# Altium schematic sheet GSM Shutter lock system.SchDoc
size A3; Address1: GSM shutter lock system; SheetNumber: 1; SheetTotal: 1
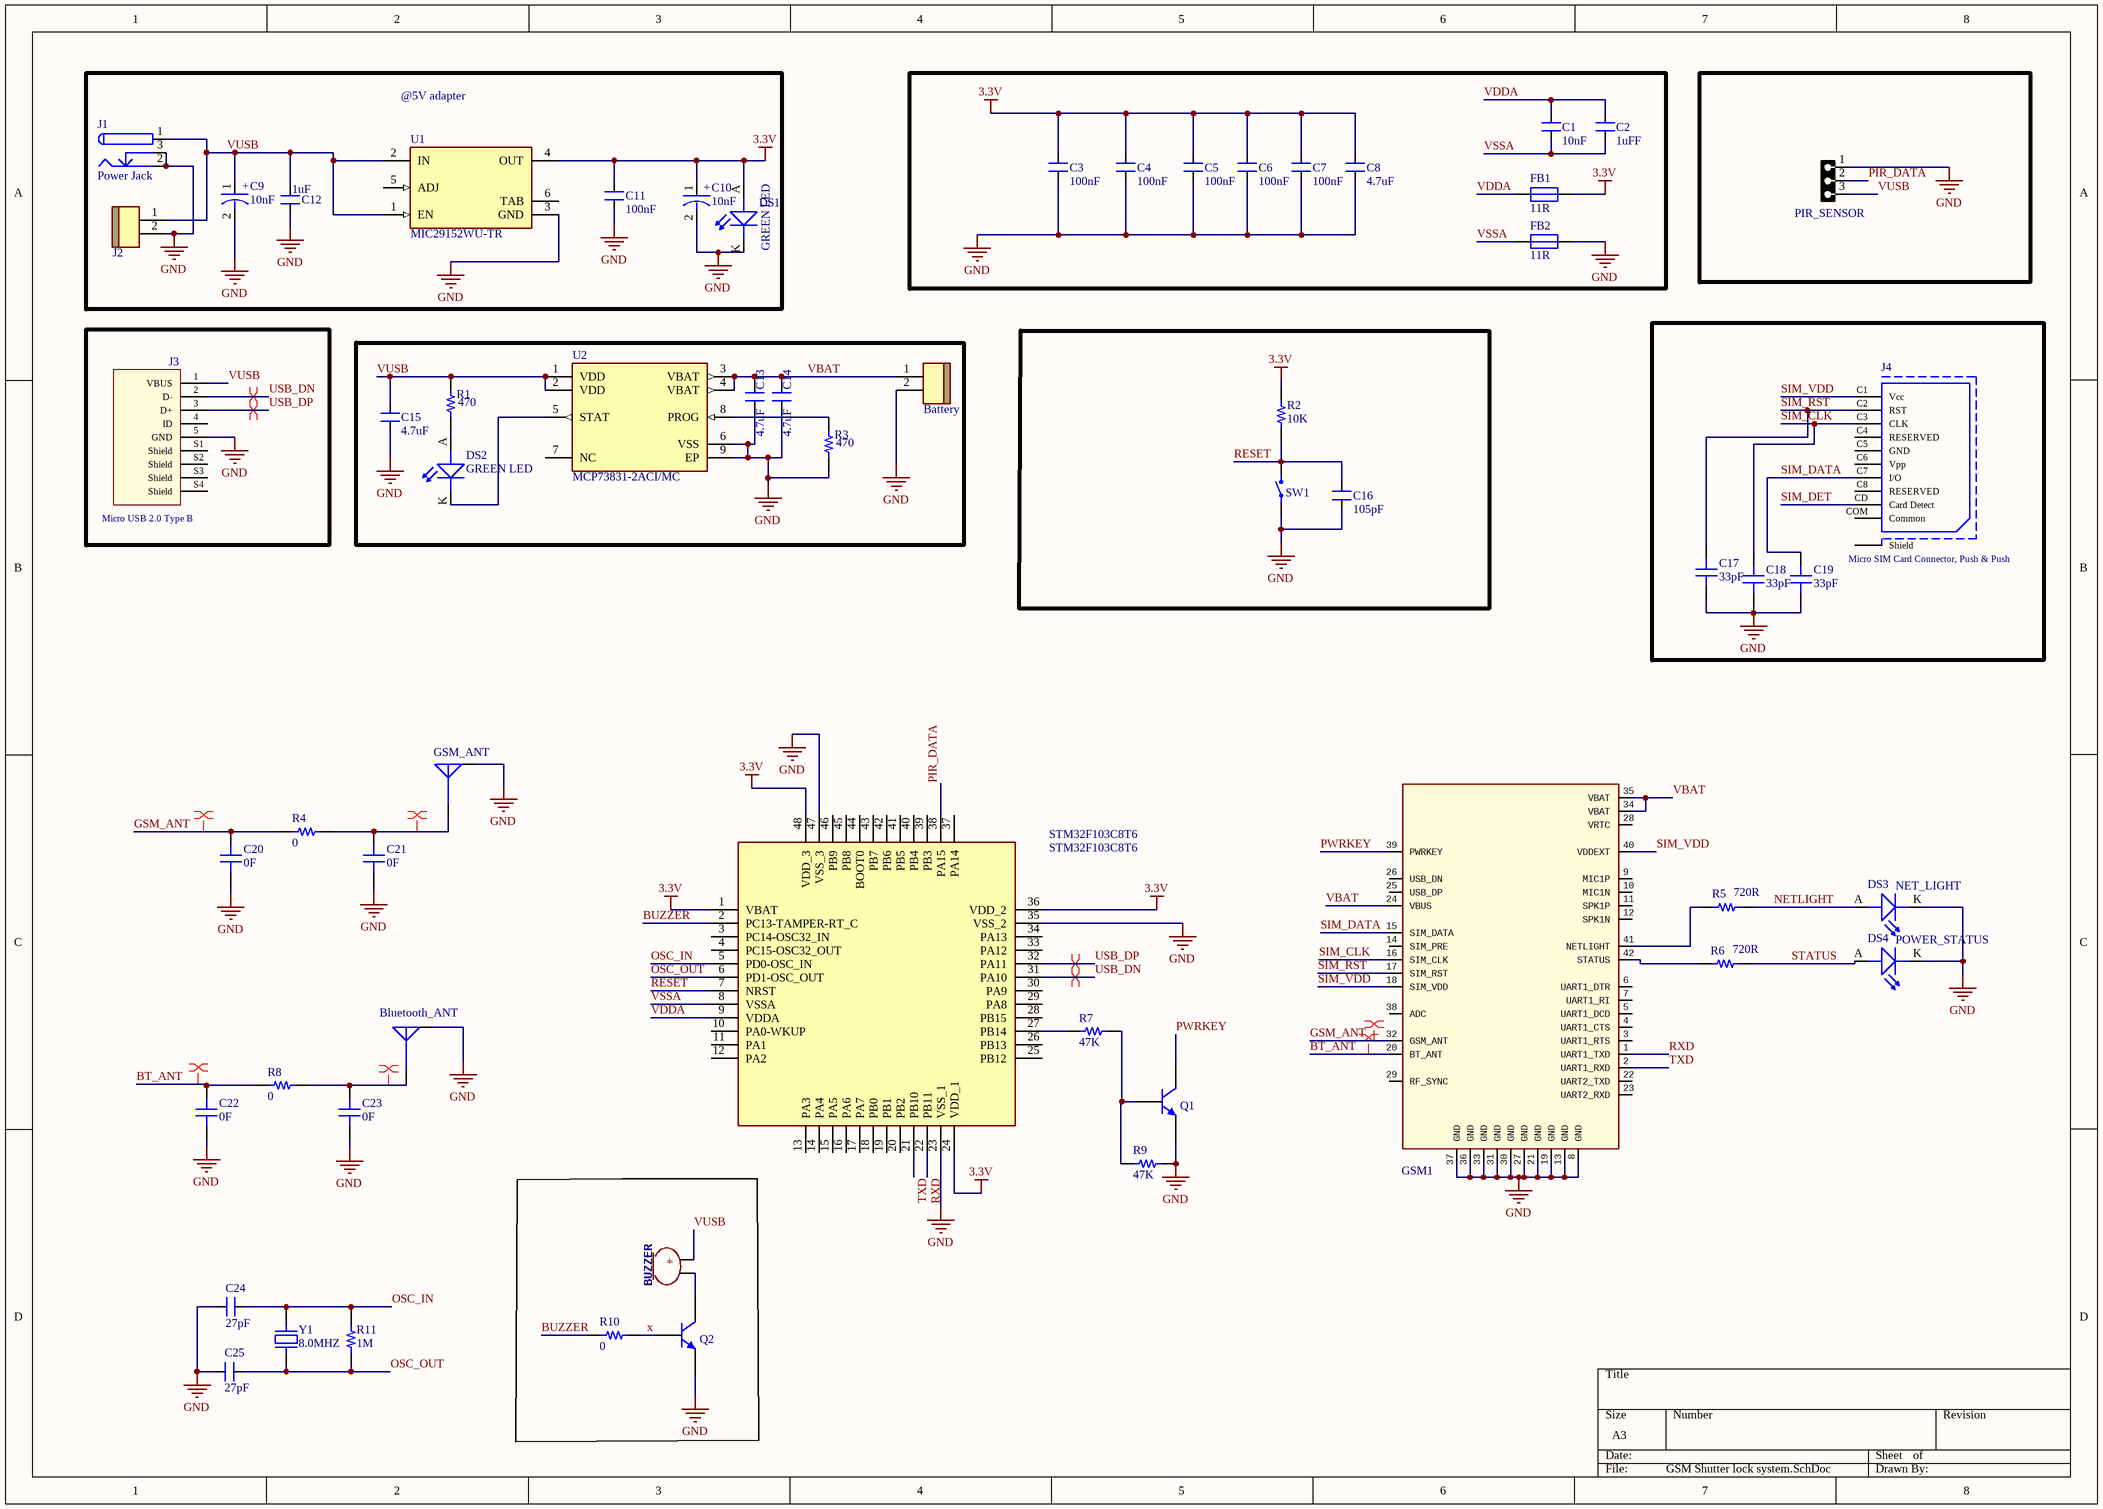
[diagram p0: GSM Shutter lock system.SchDoc]

## Parts
Battery  JST BxB-PH-K 2Pin  [JST B2B-PH-K]  (value not drawn)
Bluetooth_ANT  UFL  [MOLEX SD-734120110]  (value not drawn)
BUZZER  MK  [MIC-9.7MM-TALL]  (value not drawn)
C1  10nF  [CAP_0805]
C2  1uFF  [CAP_0805]
C3  100nF  [CAP_0805]
C4  100nF  [CAP_0805]
C5  100nF  [CAP_0805]
C6  100nF  [CAP_0805]
C7  100nF  [CAP_0805]
C8  4.7uF  [CAP_0805]
C9  10nF  [ACAP_P339_D393_H531_RAD]
C10  10nF  [ACAP_P339_D393_H531_RAD]
C11  100nF  [CAP_0805]
C12  1uF  [CAP_0805]
C13  4.7uF  [CAP_0805]
C14  4.7uF  [CAP_0805]
C15  4.7uF  [CAP_0805]
C16  105pF  [CAP_0805]
C17  33pF  [CAP 0603_1608]
C18  33pF  [CAP 0603_1608]
C19  33pF  [CAP 0603_1608]
C20  0F  [CAP 0402_1005]
C21  0F  [CAP 0402_1005]
C22  0F  [CAP 0402_1005]
C23  0F  [CAP 0402_1005]
C24  27pF  [CAP_0805]
C25  27pF  [CAP_0805]
DS1  GREEN LED  [LED_0805]
DS2  GREEN LED  [LED_0805]
DS3  NET_LIGHT  [LED_0805]
DS4  POWER_STATUS  [LED_0805]
FB1  11R  [IND_0805]
FB2  11R  [IND_0805]
GSM1  SIM800C  [Sim800C]  (value not drawn)
GSM_ANT  UFL  [MOLEX SD-734120110]  (value not drawn)
J1  Power Jack  [DC005]
J2  JST BxB-PH-K 2Pin  [JST B2B-PH-K]  (value not drawn)
J3  Micro USB 2.0 Type B  [629105150521]
J4  Micro SIM Card Connector, Push & Push  [693021010811]
PIR_SENSOR  HDRF3  [HDRLP_F_1X3]  (value not drawn)
Q1  8050  [SOT-23-3 2.9X2.4MM P0.95MM]  (value not drawn)
Q2  8050  [SOT-23-3 2.9X2.4MM P0.95MM]  (value not drawn)
R1  470  [RES 0603_1608]
R2  10K  [RES 0603_1608]
R3  470  [RES 0603_1608]
R4  0  [RES 0402_1005]
R5  720R  [RES 0603_1608]
R6  720R  [RES 0603_1608]
R7  47K  [RES 0603_1608]
R8  0  [RES 0402_1005]
R9  47K  [RES 0603_1608]
R10  0  [RES 0402_1005]
R11  1M  [RES 0603_1608]
STM32F103C8T6  STM32F103C8T6  [LQFP-48_19.6_393_58X11_SMD]
SW1  Tactile 2PIN 6X3.5mm H4.57mm (SMD)  [SWPBS_SPST_6X3X5]  (value not drawn)
U1  MIC29152WU-TR  [FP-C04-012-MFG]
U2  MCP73831-2ACI/MC  [FP-C04-123-MFG]
Y1  8.0MHZ  [HC-49S SMD]

## Blocks framed on the sheet
@5V adapter: C9-C12 DS1 J1 J2 U1

## Nets
3.3V: C3.2 C4.2 C5.2 C6.2 C7.2 C8.2 C10.1 C11.2 DS1.A(ANODE) FB1.2 R2.2 STM32F103C8T6.1(VBAT) STM32F103C8T6.24(VDD_1) STM32F103C8T6.36(VDD_2) STM32F103C8T6.48(VDD_3) U1.4(OUT)
GND: Battery.2 Bluetooth_ANT.G C3.1 C4.1 C5.1 C6.1 C7.1 C8.1 C9.2 C10.2 C11.1 C12.1 C13.1 C14.1 C15.1 C16.1 C17.1 C18.1 C19.1 C20.1 C21.1 C22.1 C23.1 C24.2 C25.2 DS1.K(CATHODE) DS3.K(CATHODE) DS4.K(CATHODE) FB2.2 GSM1.8(GND) GSM1.13(GND) GSM1.19(GND) GSM1.21(GND) GSM1.27(GND) GSM1.30(GND) GSM1.31(GND) GSM1.33(GND) GSM1.36(GND) GSM1.37(GND) GSM_ANT.G J1.2 J1.3 J2.2 J3.5(GND) PIR_SENSOR.1 Q1.2(E) Q2.2(E) R3.1 R9.1 STM32F103C8T6.23(VSS_1) STM32F103C8T6.35(VSS_2) STM32F103C8T6.47(VSS_3) SW1.1 U1.3(GND) U2.6(VSS) U2.9(EP)
BT_ANT: C22.2 GSM1.20(BT_ANT) R8.1
BUZZER: R10.1 STM32F103C8T6.2(PC13-TAMPER-RT_C)
GSM_ANT: C20.2 GSM1.32(GSM_ANT) R4.1
NETLIGHT: DS3.A(ANODE) R5.2
OSC_IN: C24.1 R11.2 STM32F103C8T6.5(PD0-OSC_IN) Y1.2
OSC_OUT: C25.1 R11.1 STM32F103C8T6.6(PD1-OSC_OUT) Y1.1
PIR_DATA: PIR_SENSOR.2 STM32F103C8T6.38(PA15)
PWRKEY: GSM1.39(PWRKEY) Q1.3(C)
RESET: C16.2 R2.1 STM32F103C8T6.7(NRST) SW1.2
RXD: GSM1.1(UART1_TXD) STM32F103C8T6.22(PB11)
SIM_CLK: C18.2 GSM1.16(SIM_CLK) J4.C3(CLK)
SIM_DATA: C19.2 GSM1.15(SIM_DATA) J4.C7(I/O)
SIM_DET: J4.CD(Card_Detect)
SIM_RST: C17.2 GSM1.17(SIM_RST) J4.C2(RST)
SIM_VDD: GSM1.18(SIM_VDD) GSM1.40(VDDEXT) J4.C1(Vcc)
STATUS: DS4.A(ANODE) R6.2
TXD: GSM1.2(UART1_RXD) STM32F103C8T6.21(PB10)
USB_DN: J3.2(D-) STM32F103C8T6.31(PA10)
USB_DP: J3.3(D+) STM32F103C8T6.32(PA11)
VBAT: Battery.1 C13.2 C14.2 GSM1.24(VBUS) GSM1.34(VBAT) GSM1.35(VBAT) U2.3(VBAT) U2.4(VBAT)
VDDA: C1.2 C2.2 FB1.1 STM32F103C8T6.9(VDDA)
VSSA: C1.1 C2.1 FB2.1 STM32F103C8T6.8(VSSA)
VUSB: BUZZER.2(OUT) C9.1 C12.2 C15.2 J1.1 J2.1 J3.1(VBUS) PIR_SENSOR.3 R1.2 U1.1(EN) U1.2(IN) U2.1(VDD) U2.2(VDD)
x: Q2.1(B) R10.2
NetBluetooth_ANT_S: Bluetooth_ANT.S C23.2 R8.2
NetBUZZER_1: BUZZER.1(GND) Q2.3(C)
NetC21_2: C21.2 GSM_ANT.S R4.2
NetDS2_A: DS2.A(ANODE) R1.1
NetDS2_K: DS2.K(CATHODE) U2.5(STAT)
NetGSM1_41: GSM1.41(NETLIGHT) R5.1
NetGSM1_42: GSM1.42(STATUS) R6.1
NetQ1_1: Q1.1(B) R7.1 R9.2
NetR3_2: R3.2 U2.8(PROG)
NetR7_2: R7.2 STM32F103C8T6.27(PB14)

Not connected (* = marked no-connect by the designer): GSM1 3(UART1_RTS) 4(UART1_CTS) 5(UART1_DCD) 6(UART1_DTR) 7(UART1_RI) 9(MIC1P) 10(MIC1N) 11(SPK1P) 12(SPK1N) 14(SIM_PRE) 22(UART2_TXD) 23(UART2_RXD) 25(USB_DP) 26(USB_DN) 28(VRTC) 29(RF_SYNC) 38(ADC); J3 4(ID) S1(Shield) S2(Shield) S3(Shield) S4(Shield); J4 C4(RESERVED) C5(GND) C6(Vpp) C8(RESERVED) COM(Common) Shield; STM32F103C8T6 3(PC14-OSC32_IN) 4(PC15-OSC32_OUT) 10(PA0-WKUP) 11(PA1) 12(PA2) 13(PA3) 14(PA4) 15(PA5) 16(PA6) 17(PA7) 18(PB0) 19(PB1) 20(PB2) 25(PB12) 26(PB13) 28(PB15) 29(PA8) 30(PA9) 33(PA12) 34(PA13) 37(PA14) 39(PB3) 40(PB4) 41(PB5) 42(PB6) 43(PB7) 44(BOOT0) 45(PB8) 46(PB9); U1 5(ADJ) 6(TAB); U2 7(NC)

## Layout directives
differential pair; differential pair class diff90; rule Differential Pairs Routing [Pref Gap = 5mil    Min Gap  = 5mil    Max Gap  = 5milPref Width = 8mil    Min Width  = 8mil    Max Width  = 8mil]: USB_DN, USB_DP
net class GSM_ANT; rule Width Constraint [Pref Impedance = 50.00ohms    Min Impedance = 50.00ohms    Max Impedance = 50.00ohms]: GSM_ANT
net class GSM_ANT: GSM_ANT, NetC21_2
net class BT_ANT: BT_ANT, NetBluetooth_ANT_S

## Notes on the sheet
- (in symbol CAP-P_10uF-400V-20%-RAD) +
- (in symbol MIC 6.0mm H3.7mm (THD)) +; _

## Library data of the parts
Battery J2 = JST BxB-PH-K 2Pin: Connector Header Through Hole 0.079" (2.00mm); PartNumber: B2B-PH-K-S(LF)(SN)
Bluetooth_ANT GSM_ANT = UFL MOLEX SD-734120110: PartNumber: MOLEX SD-734120110
BUZZER = MIC 6.0mm H3.7mm (THD): 30Hz ~ 15kHz Analog Microphone Electret Condenser 2V ~ 10V Omnidirectional (-42dB ±3dB) PC Pins; PartNumber: POM-3542P-R
C1-C8 C11-C16 C24 C25 = CAP_100pF-50V-5%-0805: 100pF ±5% 50V Ceramic Capacitor C0G, NP0 0805 (2012 Metric); Manufacturer: KEMET; Manufacturer Part Number: CC0805JRNPO9BN101; Alternate Part Number-1: NA; Case/Package: 0805; Supplier-1: SIRICOM; Supplier Part Number-1: 0805N101J500LT
C9 C10 = CAP-P_10uF-400V-20%-RAD: 10µF 400V Aluminum Electrolytic Capacitors Radial, Can - SMD 10000 Hrs @ 105°C; Manufacturer: Nichicon; Manufacturer Part Number: ULV2G100MNL1GS; Alternate Part Number-1: NA; Case/Package: Radial-SMD; Supplier-1: SP ROAD; Supplier Part Number-1: ULV2G100MNL1GS
C17-C19 = Cap 0603: SMT Capacitor; VALUE: 100nF
C20-C23 = Cap 0402: SMT Capacitor; VALUE: 100nF
DS1 DS2 DS4 = LED_GREEN-2.2-20mA-0805: Green 569nm LED Indication - Discrete 2.1V 0805 (2012 Metric); Manufacturer: Vishay Lite-On; Manufacturer Part Number: LTST-C171GKT; Alternate Part Number-1: NA; Case/Package: 0805; Supplier-1: SP ROAD; Supplier Part Number-1: LTST-C171GKT
DS3 = LED_BLUE-3V3-20mA-0805: Blue 470nm LED Indication - Discrete 3.3V 0805 (2012 Metric); Manufacturer: Vishay Lite-On; Manufacturer Part Number: LTST-C171TBKT; Alternate Part Number-1: NA; Case/Package: 0805; Supplier-1: SP ROAD; Supplier Part Number-1: LTST-C171TBKT
FB1 FB2 = FB_11R-100MHZ-1.5A-0805: 11 Ohms @ 100MHz 1 Power Line Ferrite Bead 0805 (2012 Metric) 1.5A 60mOhm; Manufacturer: Murata; Manufacturer Part Number: MI0805K110R-10; Alternate Part Number-1: NA; Case/Package: 0805; Supplier-1: SIRICOM; Supplier Part Number-1: ACMS201209A110
J1 = Power Jack: PartNumber: DC005-5.5MM
J3 = Micro USB 2.0 Type B Horizontal (SMD) 629105150521: Micro USB 2.0 Type B Horizontal SMT 5 Contacts High Current WR-COM; Rated Current: 3 A; Gender: Female; ComponentLink1Description: Manufacturer; ComponentLink1URL: http://www.we-online.de; ComponentLink2Description: Datasheet; ComponentLink2URL: http://katalog.we-online.de/em/datasheet/629105150521.pdf; PartNumber: 629105150521; Published Date: May 2018; Publisher: Wurth Elektronik; Orientation: Horizontal; Interface Type: Micro USB 2.0 Type B; Operating Temperature: -40 to 85 degC; Mounting Technology: SMT; Packaging: Tape and Reel
J4 = Micro SIM Card 693021010811: WR-CRD Micro SIM Card Connector, Push & Push, with Card Detection; Rated Current: 1A; Working Voltage: 500V AC; ComponentLink1Description: Manufacturer; ComponentLink1URL: http://www.we-online.de; ComponentLink2Description: Datasheet; ComponentLink2URL: http://katalog.we-online.de/em/datasheet/693021010811.pdf; PartNumber: 693021010811; Published Date: Feb. 2018; Publisher: Wurth Elektronik; Operating Temperature: -25 to 85 degC; Mounting Technology: SMT
PIR_SENSOR = HDRLP_F_1X3: CONN, HEADER, Male, pitch: 2.54mm, 3POS; VALUE: HDRF3
Q1 Q2 = MMSS8050 (SMD): Bipolar (BJT) Transistor NPN 25V 1.5A 100MHz 625mW Surface Mount SOT-23; PartNumber: MMSS8050-L-TP
R1-R3 R5-R7 R9 R11 = Res 0603: SMT Resistor; VALUE: 1K
R4 R8 R10 = Res 0402: SMT Resistor; VALUE: 1K
STM32F103C8T6 = IC_STM32F103C8T6: ARM® Cortex®-M3 STM32F1 Microcontroller IC 32-Bit 72MHz 64KB (64K x 8) FLASH 48-LQFP (7x7); Manufacturer: STMicroelectronics; Alternate Part Number-1: NA; Manufacturer Part Number: STM32F103C8T6; Case/Package: LQFP48; Supplier-1: LCSC; Supplier Part Number-1: STM32F103C8T6
SW1 = Tactile 2PIN 6X3.5mm H4.57mm (SMD): Tactile Switch SPST-NO Top Actuated Surface Mount; PartNumber: FSMSMTR-ND
U1 = CMP-06324-000048-1: IC REG LIN POS ADJ 1.5A TO263-5; Output Voltage: 26V; Min Input Voltage: 2.5V; Input Bias Current: 40nA; Number of Outputs: 1; Output Type: Adjustable; Output Voltage Accuracy: 1%; Dropout Voltage: 350mV; Polarity: Positive; Quiescent Current: 20mA; Reference Voltage: 1.24V; Mount: Surface Mount; Packaging: Tape and Reel; Min Operating Temperature: -40°C; Length: 10.67mm; Case/Package: TO-263-5; Max Input Voltage: 26V; RoHS Compliant: Yes; Number of Pins: 6; Height: 4.59mm; Max Output Current: 1.5A; Number of Regulators: 1; Max Operating Temperature: 125°C; Width: 9.17mm; Series: -; Accuracy: 1%; Lead Free: Lead Free; Radiation Hardening: No; Output Current: 1.5A
U2 = CMP-06318-000002-1: IC CONTROLLER LI-ION 4.2V 8DFN; Manufacturer: Microchip; Number Of Cells: 1; Min Supply Voltage: 3.75V; Standoff Height: 0mm; Nominal Supply Current: 0.1-510uA; Max Junction Temp: +125°C; Max Supply Voltage: 6V; Temperature Range High: +85°C; Mouser Description: Battery Management Li-Ion/Li-Poly Charg Mgnt 4.2V Vreg out; Device Class L2: Power Management ICs; ComponentLink2Description: Datasheet; Footprint Url: http://ww1.microchip.com/downloads/en/DeviceDoc/8L_DFN_2x3x0_9_MC_C04-123C.pdf; Output Voltage: 4.2V; ComponentLink2URL: http://ww1.microchip.com/downloads/en/DeviceDoc/20001984g.pdf; Package: C04-123; Ipc Land Pattern Name: DFN200X300X90-8; Number Of Outputs: 1; Manufacturer Part Number: MCP73831-2ACI/MC; Device Class L3: Battery Management; Device Class L1: Integrated Circuits (ICs); Digikey Description: IC CONTROLLER LI-ION 4.2V 8DFN; Category: IC; Temperature Range Low: -40°C; Automotive: No; Temperature: -40°C to +85°C; Octopart: https://octopart.com/mcp73831-2aci%2Fmc-microchip-16517355; RoHS: TRUE; Ambient Temperature Range Low: -40°C; Height: 1mm; Lead Free: Yes; Ambient Temperature Range High: +85°C
Y1 = Crystal HC-49S SMD: SMT Crystal; VALUE: 8.0MHZ